# Altium schematic sheet con-left-bot.SchDoc: Left Bottom Connector
size Letter; CheckedBy: J. Brinton; CompanyName: Signal Laboratories, Inc.; DrawnBy: J. Brinton; Engineer: J. Brinton; Address1: 3479 Edison Way; Address2: Menlo Park CA 94025; Address3: +1 (877) 778-8435; Address4: siglabs.com; Revision: 3; SheetNumber: 48; SheetTotal: 49; ModifiedDate: 4/20/2018
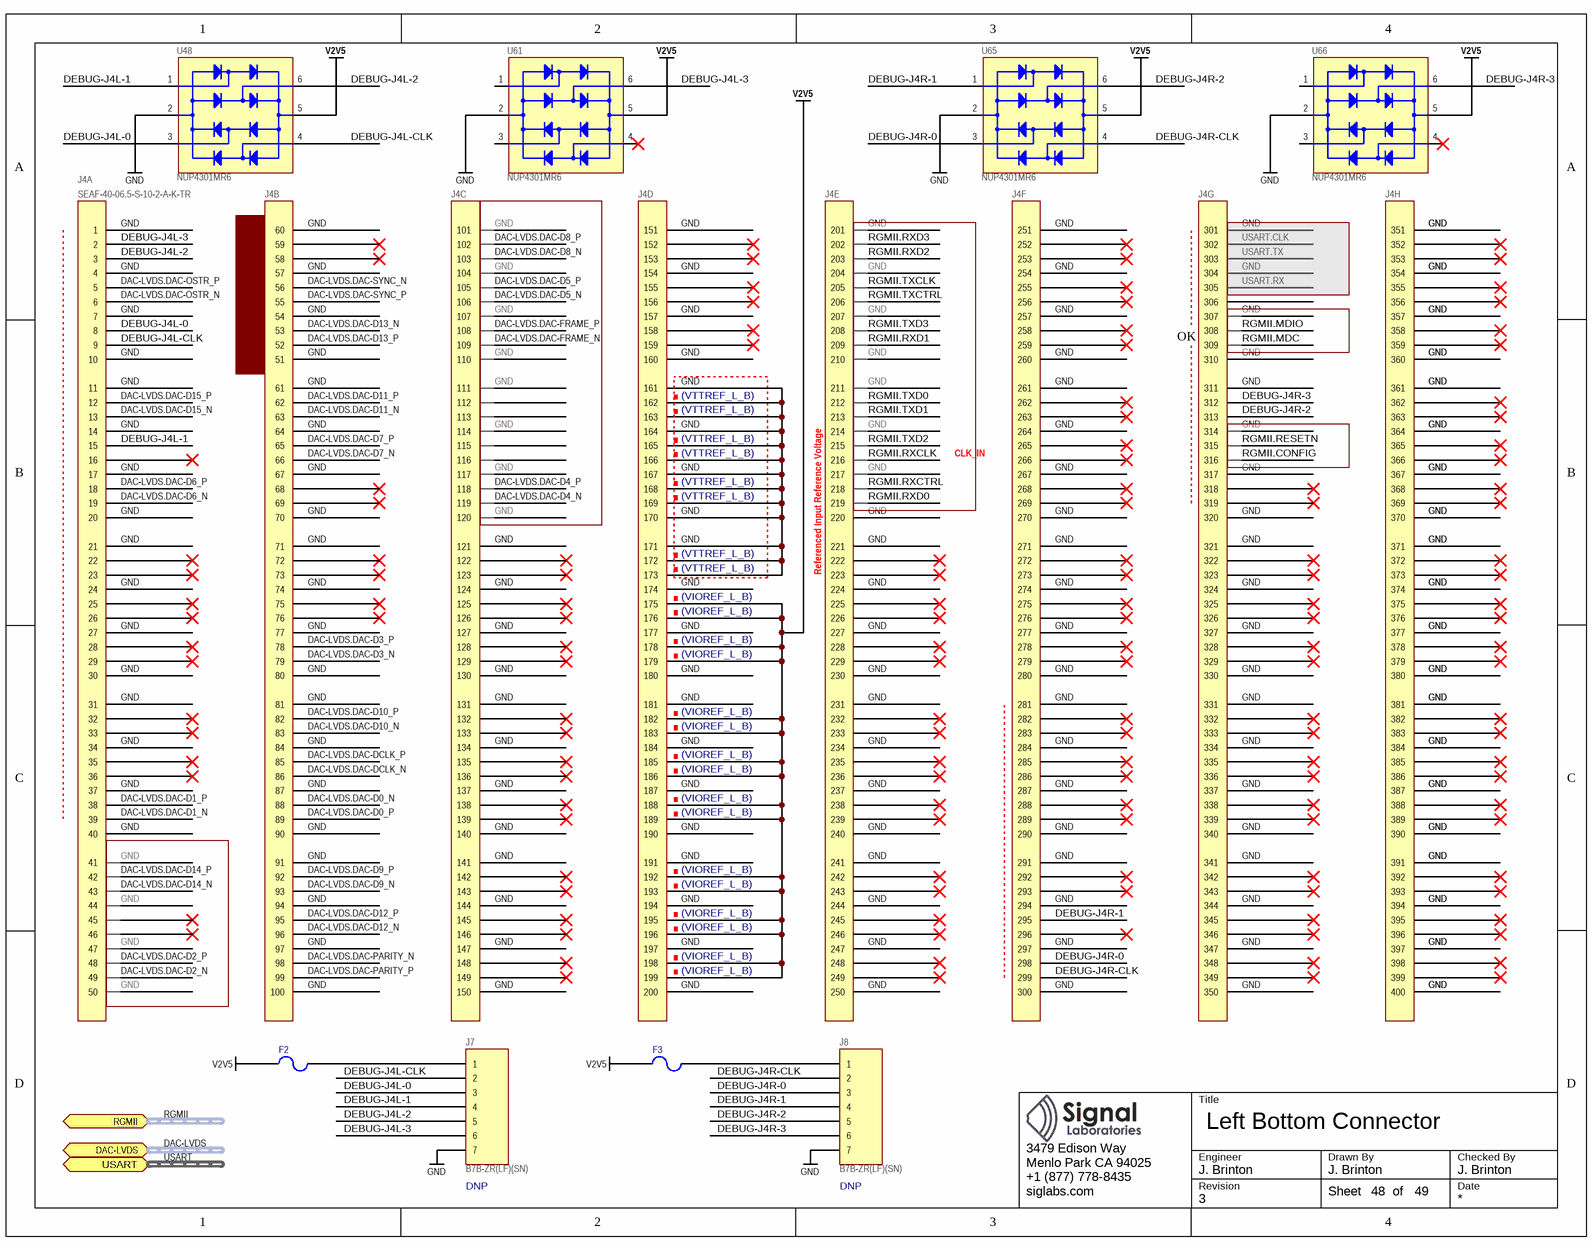
[diagram p0: con-left-bot.SchDoc]

## Parts
F2  0ZCJ0020FF2E  [1206]  (value not drawn)
F3  0ZCJ0020FF2E  [1206]  (value not drawn)
J4  SEAF-40-06.5-S-10-2-A-K-TR  [SEAF-40-06.5-S-10-2-A-K-TR]  (parts A,B,C,D,E,F,G,H of 8)
J7  B7B-ZR(LF)(SN)  Do Not Place: DNP  [B7B-ZR]
J8  B7B-ZR(LF)(SN)  Do Not Place: DNP  [B7B-ZR]
U48  NUP4301MR6  [SOT23-6]
U61  NUP4301MR6  [SOT23-6]
U65  NUP4301MR6  [SOT23-6]
U66  NUP4301MR6  [SOT23-6]

## Ports
DAC-LVDS (harness DAC-LVDS), RGMII (harness RGMII), USART (harness USART-2V5)

## Nets
GND: J4.1 J4.4 J4.7 J4.10 J4.11 J4.14 J4.17 J4.20 J4.21 J4.24 J4.27 J4.30 J4.31 J4.34 J4.37 J4.40 J4.41 J4.44 J4.47 J4.50 J4.51 J4.54 J4.57 J4.60 J4.61 J4.64 J4.67 J4.70 J4.71 J4.74 J4.77 J4.80 J4.81 J4.84 J4.87 J4.90 J4.91 J4.94 J4.97 J4.100 J4.101 J4.104 J4.107 J4.110 J4.111 J4.114 J4.117 J4.120 J4.121 J4.124 J4.127 J4.130 J4.131 J4.134 J4.137 J4.140 J4.141 J4.144 J4.147 J4.150 J4.151 J4.154 J4.157 J4.160 J4.161 J4.162 J4.163 J4.164 J4.165 J4.166 J4.167 J4.168 J4.169 J4.170 J4.171 J4.172 J4.173 J4.174 J4.177 J4.180 J4.181 J4.184 J4.187 J4.190 J4.191 J4.194 J4.197 J4.200 J4.201 J4.204 J4.207 J4.210 J4.211 J4.214 J4.217 J4.220 J4.221 J4.224 J4.227 J4.230 J4.231 J4.234 J4.237 J4.240 J4.241 J4.244 J4.247 J4.250 J4.251 J4.254 J4.257 J4.260 J4.261 J4.264 J4.267 J4.270 J4.271 J4.274 J4.277 J4.280 J4.281 J4.284 J4.287 J4.290 J4.291 J4.294 J4.297 J4.300 J4.301 J4.304 J4.307 J4.310 J4.311 J4.314 J4.317 J4.320 J4.321 J4.324 J4.327 J4.330 J4.331 J4.334 J4.337 J4.340 J4.341 J4.344 J4.347 J4.350 J4.351 J4.354 J4.357 J4.360 J4.361 J4.364 J4.367 J4.370 J4.371 J4.374 J4.377 J4.380 J4.381 J4.384 J4.387 J4.390 J4.391 J4.394 J4.397 J4.400 J7.7 J8.7 U48.2(VN) U61.2(VN) U65.2(VN) U66.2(VN)
V2V5: F2.2 F3.2 J4.175 J4.176 J4.178 J4.179 J4.182 J4.183 J4.185 J4.186 J4.188 J4.189 J4.192 J4.193 J4.195 J4.196 J4.198 J4.199 U48.5(VP) U61.5(VP) U65.5(VP) U66.5(VP)
DAC-LVDS.DAC-D0_N: J4.88
DAC-LVDS.DAC-D0_P: J4.89
DAC-LVDS.DAC-D1_N: J4.39
DAC-LVDS.DAC-D1_P: J4.38
DAC-LVDS.DAC-D2_N: J4.49
DAC-LVDS.DAC-D2_P: J4.48
DAC-LVDS.DAC-D3_N: J4.79
DAC-LVDS.DAC-D3_P: J4.78
DAC-LVDS.DAC-D4_N: J4.119
DAC-LVDS.DAC-D4_P: J4.118
DAC-LVDS.DAC-D5_N: J4.106
DAC-LVDS.DAC-D5_P: J4.105
DAC-LVDS.DAC-D6_N: J4.19
DAC-LVDS.DAC-D6_P: J4.18
DAC-LVDS.DAC-D7_N: J4.66
DAC-LVDS.DAC-D7_P: J4.65
DAC-LVDS.DAC-D8_N: J4.103
DAC-LVDS.DAC-D8_P: J4.102
DAC-LVDS.DAC-D9_N: J4.93
DAC-LVDS.DAC-D9_P: J4.92
DAC-LVDS.DAC-D10_N: J4.83
DAC-LVDS.DAC-D10_P: J4.82
DAC-LVDS.DAC-D11_N: J4.63
DAC-LVDS.DAC-D11_P: J4.62
DAC-LVDS.DAC-D12_N: J4.96
DAC-LVDS.DAC-D12_P: J4.95
DAC-LVDS.DAC-D13_N: J4.53
DAC-LVDS.DAC-D13_P: J4.52
DAC-LVDS.DAC-D14_N: J4.43
DAC-LVDS.DAC-D14_P: J4.42
DAC-LVDS.DAC-D15_N: J4.13
DAC-LVDS.DAC-D15_P: J4.12
DAC-LVDS.DAC-DCLK_N: J4.86
DAC-LVDS.DAC-DCLK_P: J4.85
DAC-LVDS.DAC-FRAME_N: J4.109
DAC-LVDS.DAC-FRAME_P: J4.108
DAC-LVDS.DAC-OSTR_N: J4.6
DAC-LVDS.DAC-OSTR_P: J4.5
DAC-LVDS.DAC-PARITY_N: J4.98
DAC-LVDS.DAC-PARITY_P: J4.99
DAC-LVDS.DAC-SYNC_N: J4.56
DAC-LVDS.DAC-SYNC_P: J4.55
DEBUG-J4L-0: J4.8 J7.3 U48.3(B)
DEBUG-J4L-1: J4.15 J7.4 U48.1(A)
DEBUG-J4L-2: J4.3 J7.5 U48.6(D)
DEBUG-J4L-3: J4.2 J7.6 U61.6(D)
DEBUG-J4L-CLK: J4.9 J7.2 U48.4(C)
DEBUG-J4R-0: J4.298 J8.3 U65.3(B)
DEBUG-J4R-1: J4.295 J8.4 U65.1(A)
DEBUG-J4R-2: J4.313 J8.5 U65.6(D)
DEBUG-J4R-3: J4.312 J8.6 U66.6(D)
DEBUG-J4R-CLK: J4.299 J8.2 U65.4(C)
RGMII.CONFIG: J4.316
RGMII.MDC: J4.309
RGMII.MDIO: J4.308
RGMII.RESETN: J4.315
RGMII.RXCLK: J4.216
RGMII.RXCTRL: J4.218
RGMII.RXD0: J4.219
RGMII.RXD1: J4.209
RGMII.RXD2: J4.203
RGMII.RXD3: J4.202
RGMII.TXCLK: J4.205
RGMII.TXCTRL: J4.206
RGMII.TXD0: J4.212
RGMII.TXD1: J4.213
RGMII.TXD2: J4.215
RGMII.TXD3: J4.208
USART.CLK: J4.302
USART.RX: J4.305
USART.TX: J4.303
NetF2_1: F2.1 J7.1
NetF3_1: F3.1 J8.1

Not connected (* = marked no-connect by the designer): J4 16* 22* 23* 25* 26* 28* 29* 32* 33* 35* 36* 45* 46* 58* 59* 68* 69* 72* 73* 75* 76* 112 113 115 116 122* 123* 125* 126* 128* 129* 132* 133* 135* 136* 138* 139* 142* 143* 145* 146* 148* 149* 152* 153* 155* 156* 158* 159* 222* 223* 225* 226* 228* 229* 232* 233* 235* 236* 238* 239* 242* 243* 245* 246* 248* 249* 252* 253* 255* 256* 258* 259* 262* 263* 265* 266* 268* 269* 272* 273* 275* 276* 278* 279* 282* 283* 285* 286* 288* 289* 292* 293* 296* 306 318* 319* 322* 323* 325* 326* 328* 329* 332* 333* 335* 336* 338* 339* 342* 343* 345* 346* 348* 349* 352* 353* 355* 356* 358* 359* 362* 363* 365* 366* 368* 369* 372* 373* 375* 376* 378* 379* 382* 383* 385* 386* 388* 389* 392* 393* 395* 396* 398* 399*; U61 1(A) 3(B) 4(C)*; U66 1(A) 3(B) 4(C)*

## Buses and harness runs
harness DAC-LVDS = port DAC-LVDS
harness RGMII = port RGMII
harness USART = port USART

## Notes on the sheet
- (near J4) (VTTREF_L_B)
- (near J4) OK
- (near J4) CLK_IN
- (near J4) (VIOREF_L_B)
- (near J4) Referenced Input Reference Voltage
- Title
- Engineer
- Revision
- Drawn By
- Checked By
- Date
- Sheet
- of

## Library data of the parts
F2 F3 = 0ZCJ0020FF2E: PTC Resettable Fuse, 0.2A, 30V, SMD 1206; Manufacturer: Bell Fuse; Manufacturer P/N: 0ZCJ0020FF2E; Package: 1206
J4 = SEAF-40-06.5-S-10-2-A-K-TR: Terminal Array Assembly, Surface Mount, 0.050" Pitch, 400 Pins; Manufacturer: Samtec; Manufacturer P/N: SEAF-40-06.5-S-10-2-A-K-TR
J7 J8 = B7B-ZR(LF)(SN): Through-hole Shrouded Header 7-Position; Manufacturer: JST; Manufacturer P/N: B7B-ZR(LF)(SN)
U48 U61 U65 U66 = NUP4301MR6: 4-Lane TVS Diode Array; Manufacturer: On Semiconductor; Manufacturer P/N: NUP4301MR6